# Altium schematic sheet Sheet1.SchDoc
size A4
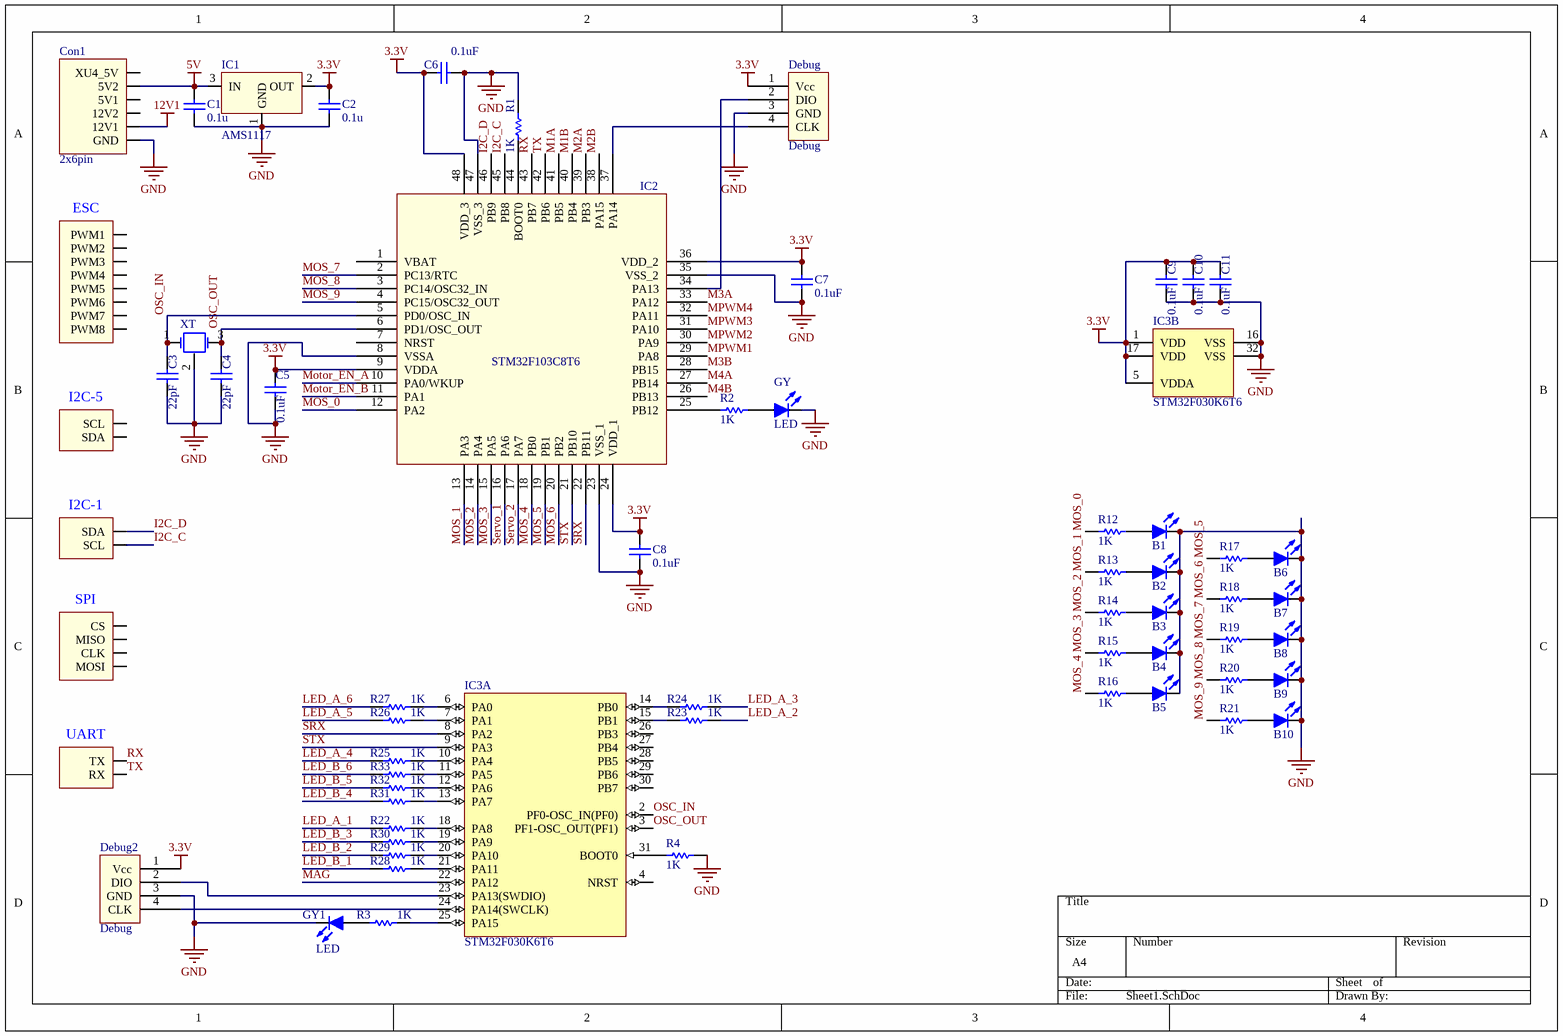
[diagram p0: Sheet1.SchDoc]

## Parts
B1  LED  [LED-0805]  (value not drawn)
B2  LED  [LED-0805]  (value not drawn)
B3  LED  [LED-0805]  (value not drawn)
B4  LED  [LED-0805]  (value not drawn)
B5  LED  [LED-0805]  (value not drawn)
B6  LED  [LED-0805]  (value not drawn)
B7  LED  [LED-0805]  (value not drawn)
B8  LED  [LED-0805]  (value not drawn)
B9  LED  [LED-0805]  (value not drawn)
B10  LED  [LED-0805]  (value not drawn)
C1  0.1u  [C0805]
C2  0.1u  [C0805]
C3  22pF  [C0805]
C4  22pF  [C0805]
C5  0.1uF  [C0805]
C6  0.1uF  [C0805]
C7  0.1uF  [C0805]
C8  0.1uF  [C0805]
C9  0.1uF  [C0805]
C10  0.1uF  [C0805]
C11  0.1uF  [C0805]
Con1  2x6pin  [2x6pin]
Con2  2x10pin  [2x10pin]  (value not drawn)  (parts A,B,C,D,E of 5)
Debug  Debug  [Debug_SMD]
Debug2  Debug  [Debug_SMD]
GY  LED  [LED-0805]
GY1  LED  [LED-0805]
IC1  AMS1117  [SOT-223]
IC2  STM32F103C8T6  [LQFP48]
IC3  STM32F030K6T6  [LQFP-32]  (parts A,B of 2)
R1  1K  [R0805]
R2  1K  [R0805]
R3  1K  [R0805]
R4  1K  [R0805]
R12  1K  [R0805]
R13  1K  [R0805]
R14  1K  [R0805]
R15  1K  [R0805]
R16  1K  [R0805]
R17  1K  [R0805]
R18  1K  [R0805]
R19  1K  [R0805]
R20  1K  [R0805]
R21  1K  [R0805]
R22  1K  [R0805]
R23  1K  [R0805]
R24  1K  [R0805]
R25  1K  [R0805]
R26  1K  [R0805]
R27  1K  [R0805]
R28  1K  [R0805]
R29  1K  [R0805]
R30  1K  [R0805]
R31  1K  [R0805]
R32  1K  [R0805]
R33  1K  [R0805]
XT  8MHz  [3225-P]  (value not drawn)

## Nets
3.3V: C2.2 C5.2 C6.1 C7.2 C8.2 C9.2 C10.2 C11.2 Debug.1(Vcc) Debug2.1(Vcc) IC1.2(OUT) IC2.9(VDDA) IC2.24(VDD_1) IC2.36(VDD_2) IC2.48(VDD_3) IC3.1(VDD) IC3.5(VDDA) IC3.17(VDD)
5V: C1.2 Con1.2(5V2) IC1.3(IN)
12V1: Con1.5(12V1)
GND: B1.2(K) B2.2(K) B3.2(K) B4.2(K) B5.2(K) B6.2(K) B7.2(K) B8.2(K) B9.2(K) B10.2(K) C1.1 C2.1 C3.2 C4.2 C5.1 C6.2 C7.1 C8.1 C9.1 C10.1 C11.1 Con1.6(GND) Debug.3(GND) Debug2.3(GND) GY.2(K) GY1.2(K) IC1.1(GND) IC2.8(VSSA) IC2.23(VSS_1) IC2.35(VSS_2) IC2.47(VSS_3) IC3.16(VSS) IC3.32(VSS) R1.2 R4.2 XT.2
I2C_C: Con2.14(SCL) IC2.45(PB8)
I2C_D: Con2.13(SDA) IC2.46(PB9)
LED_A_1: R22.1
LED_A_2: R23.2
LED_A_3: R24.2
LED_A_4: R25.1
LED_A_5: R26.1
LED_A_6: R27.1
LED_B_1: R28.1
LED_B_2: R29.1
LED_B_3: R30.1
LED_B_4: R31.1
LED_B_5: R32.1
LED_B_6: R33.1
M1A: IC2.41(PB5)
M1B: IC2.40(PB4)
M2A: IC2.39(PB3)
M2B: IC2.38(PA15)
M3A: IC2.33(PA12)
M3B: IC2.28(PB15)
M4A: IC2.27(PB14)
M4B: IC2.26(PB13)
MAG: IC3.22(PA12)
MOS_0: IC2.12(PA2) R12.1
MOS_1: IC2.13(PA3) R13.1
MOS_2: IC2.14(PA4) R14.1
MOS_3: IC2.15(PA5) R15.1
MOS_4: IC2.18(PB0) R16.1
MOS_5: IC2.19(PB1) R17.1
MOS_6: IC2.20(PB2) R18.1
MOS_7: IC2.2(PC13/RTC) R19.1
MOS_8: IC2.3(PC14/OSC32_IN) R20.1
MOS_9: IC2.4(PC15/OSC32_OUT) R21.1
Motor_EN_A: IC2.10(PA0/WKUP)
Motor_EN_B: IC2.11(PA1)
MPWM1: IC2.29(PA8)
MPWM2: IC2.30(PA9)
MPWM3: IC2.31(PA10)
MPWM4: IC2.32(PA11)
OSC_IN: C3.1 IC2.5(PD0/OSC_IN) IC3.2(PF0-OSC_IN(PF0)) XT.1(OSC1)
OSC_OUT: C4.1 IC2.6(PD1/OSC_OUT) IC3.3(PF1-OSC_OUT(PF1)) XT.3(OSC2)
RX: Con2.19(TX) IC2.43(PB7)
Servo_1: IC2.16(PA6)
Servo_2: IC2.17(PA7)
SRX: IC2.22(PB11) IC3.8(PA2)
STX: IC2.21(PB10) IC3.9(PA3)
TX: Con2.20(RX) IC2.42(PB6)
NetB1_1: B1.1(A) R12.2
NetB2_1: B2.1(A) R13.2
NetB3_1: B3.1(A) R14.2
NetB4_1: B4.1(A) R15.2
NetB5_1: B5.1(A) R16.2
NetB6_1: B6.1(A) R17.2
NetB7_1: B7.1(A) R18.2
NetB8_1: B8.1(A) R19.2
NetB9_1: B9.1(A) R20.2
NetB10_1: B10.1(A) R21.2
NetDebug2_2: Debug2.2(DIO) IC3.23(PA13(SWDIO))
NetDebug2_4: Debug2.4(CLK) IC3.24(PA14(SWCLK))
NetDebug_2: Debug.2(DIO) IC2.34(PA13)
NetDebug_4: Debug.4(CLK) IC2.37(PA14)
NetGY1_1: GY1.1(A) R3.1
NetGY_1: GY.1(A) R2.2
NetIC2_25: IC2.25(PB12) R2.1
NetIC2_44: IC2.44(BOOT0) R1.1
NetIC3_6: IC3.6(PA0) R27.2
NetIC3_7: IC3.7(PA1) R26.2
NetIC3_10: IC3.10(PA4) R25.2
NetIC3_11: IC3.11(PA5) R33.2
NetIC3_12: IC3.12(PA6) R32.2
NetIC3_13: IC3.13(PA7) R31.2
NetIC3_14: IC3.14(PB0) R24.1
NetIC3_15: IC3.15(PB1) R23.1
NetIC3_18: IC3.18(PA8) R22.2
NetIC3_19: IC3.19(PA9) R30.2
NetIC3_20: IC3.20(PA10) R29.2
NetIC3_21: IC3.21(PA11) R28.2
NetIC3_25: IC3.25(PA15) R3.2
NetIC3_31: IC3.31(BOOT0) R4.1

Not connected (* = marked no-connect by the designer): Con1 1(XU4_5V) 3(5V1) 4(12V2); Con2 1(PWM1) 2(PWM2) 3(PWM3) 4(PWM4) 5(PWM5) 6(PWM6) 7(PWM7) 8(PWM8) 11(SCL) 12(SDA) 15(CS) 16(MISO) 17(CLK) 18(MOSI); IC2 1(VBAT) 7(NRST); IC3 4(NRST) 26(PB3) 27(PB4) 28(PB5) 29(PB6) 30(PB7)

## Notes on the sheet
- (in symbol 2x10pin, part A) ESC
- (in symbol 2x10pin, part B) I2C-5
- (in symbol 2x10pin, part C) I2C-1
- (in symbol 2x10pin, part D) SPI
- (in symbol 2x10pin, part E) UART

## Library data of the parts
C1 C2 C9-C11 = Cap: value: *
C3-C8 = Capacitor: value: *
IC3 = STM32F030K6T6: ARM Cortex-M0 32-bit MCU, 32 KB Flash, 4 KB Internal RAM, 26 I/Os, 32-pin LQFP, -40 to 85 degC, Tray; FLASH Size (Prog) (kB): 32; I/Os (High Current): 26; Internal RAM Size (kB): 4; Operating Frequency(F) (Processor speed) (MHz): 48; Supply Voltage(Vcc) min (V): 2.4; DatasheetVersion: Rev. 1; PackageVersion: Rev. 1, 07/2013; PackageReference: LQFP32; PackageDescription: 32-Pin Low Profile Quad Flat Package, 7 x 7 mm Body, 0.8 mm Pitch; Supplier 1: Digi-Key; Supplier Part Number 1: 497-14046-ND; Supplier 2: Newark; Supplier Part Number 2: 19X6194; Supplier 3: Mouser; Supplier Part Number 3: 511-STM32F030K6T6; Core: ARM Cortex-M0; Packing: Tray; Mounting Technology: Surface Mount; PartNumber: STM32F030K6T6; ComponentLink1Description: Manufacturer URL; ComponentLink1URL: http://www.st.com/web/en/home.html; ComponentLink2Description: Datasheet; ComponentLink2URL: http://www.st.com/st-web-ui/static/active/en/resource/technical/document/datasheet/DM00088500.pdf; ComponentLink3Description: Package Specification; ComponentLink3URL: http://www.st.com/st-web-ui/static/active/en/resource/technical/document/datasheet/DM00088500.pdf
R1-R4 R12-R33 = Resistor: value: *
XT = Passive Crystal: frequency: *